# Altium project SCX10.PrjPCB
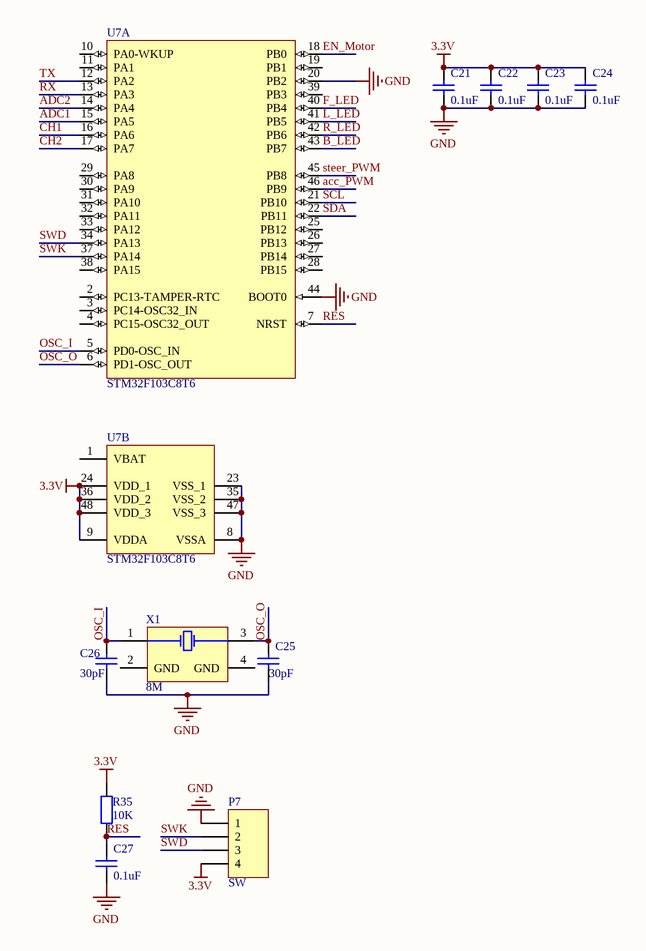
[diagram p0: SCX10.SchDoc]
3 sheets, 82 parts. Net scope: global (net labels, ports and power ports of the same name join across sheets).
Board file: SCX10.PcbDoc
Sheets:
  SCX10.SchDoc
  power.SchDoc
  driver.SchDoc

## Sheet SCX10.SchDoc
size A4

### Parts
C21  0.1uF  [C0603]
C22  0.1uF  [C0603]
C23  0.1uF  [C0603]
C24  0.1uF  [C0603]
C25  30pF  [C0603]
C26  30pF  [C0603]
C27  0.1uF  [C0603]
P7  SW  [HDR1X4]
R35  10K  [R0603]
U7  STM32F103C8T6  [STM-LQFP48-L]  (parts A,B of 2)
X1  8M  [XTAL-8M]

### Nets
3.3V: C21.2 C22.2 C23.2 C24.2 P7.4 R35.2 U7.9(VDDA) U7.24(VDD_1) U7.36(VDD_2) U7.48(VDD_3)
GND: C21.1 C22.1 C23.1 C24.1 C25.1 C26.1 C27.1 P7.1 U7.8(VSSA) U7.20(PB2) U7.23(VSS_1) U7.35(VSS_2) U7.44(BOOT0) U7.47(VSS_3)
acc_PWM: U7.46(PB9)
ADC1: U7.15(PA5)
ADC2: U7.14(PA4)
B_LED: U7.43(PB7)
CH1: U7.16(PA6)
CH2: U7.17(PA7)
EN_Motor: U7.18(PB0)
F_LED: U7.40(PB4)
L_LED: U7.41(PB5)
OSC_I: C26.2 U7.5(PD0-OSC_IN) X1.1(X1)
OSC_O: C25.2 U7.6(PD1-OSC_OUT) X1.3(X2)
R_LED: U7.42(PB6)
RES: C27.2 R35.1 U7.7(NRST)
RX: U7.13(PA3)
SCL: U7.21(PB10)
SDA: U7.22(PB11)
steer_PWM: U7.45(PB8)
SWD: P7.3 U7.34(PA13)
SWK: P7.2 U7.37(PA14)
TX: U7.12(PA2)

Not connected (* = marked no-connect by the designer): U7 1(VBAT) 2(PC13-TAMPER-RTC) 3(PC14-OSC32_IN) 4(PC15-OSC32_OUT) 10(PA0-WKUP) 11(PA1) 19(PB1) 25(PB12) 26(PB13) 27(PB14) 28(PB15) 29(PA8) 30(PA9) 31(PA10) 32(PA11) 33(PA12) 38(PA15) 39(PB3); X1 2(GND) 4(GND)

### Library data of the parts
C21-C27 = Cap: Capacitor; Value: 100pF; Published: 8-Jun-2000; LatestRevisionDate: 17-Jul-2002; LatestRevisionNote: Re-released for DXP Platform.; PackageReference: RAD-0.3; Publisher: Altium Limited; PackageDescription: Radial Cap, Thru-Hole; 2 Leads; 0.3 in Pin Spacing
P7 = Header 4: Header, 4-Pin; LatestRevisionDate: 17-Jul-2002; LatestRevisionNote: Re-released for DXP Platform.; Publisher: Altium Limited
R35 = Res2: Resistor; Value: 1K; Published: 8-Jun-2000; LatestRevisionDate: 17-Jul-2002; LatestRevisionNote: Re-released for DXP Platform.; PackageReference: AXIAL-0.4; Publisher: Altium Limited; PackageDescription: Axial Device, Thru-Hole; 2 Leads; 0.4 in Pin Spacing
X1 = XTAL-8M

## Sheet power.SchDoc
size A4
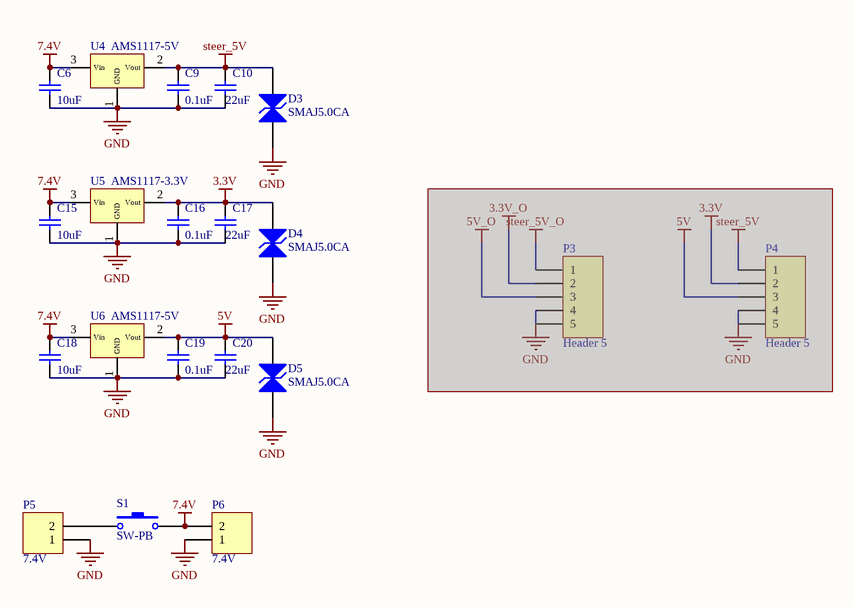
[diagram p1: power.SchDoc]

### Parts
(Parts that share a designator on the sheet are numbered #1, #2 ... from top to bottom, then left to right.)
C6  10uF  [C0603]
C9  0.1uF  [C0603]
C10  22uF  [C0603]
C15  10uF  [C0603]
C16  0.1uF  [C0603]
C17  22uF  [C0603]
C18  10uF  [C0603]
C19  0.1uF  [C0603]
C20  22uF  [C0603]
D3  SMAJ5.0CA  [DO-214AC]
D4  SMAJ5.0CA  [DO-214AC]
D5  SMAJ5.0CA  [DO-214AC]
P3#1  Header 5  [HDR1X5]  (masked out: inside a compile mask, not in the netlist)
P4  Header 5  [HDR1X5]  (masked out: inside a compile mask, not in the netlist)
P5  7.4V  [7.4V]
P6  7.4V  [7.4V]
S1  SW-PB  [7.4V]
U4  AMS1117-5V  [SOT-89]
U5  AMS1117-3.3V  [SOT-89]
U6  AMS1117-5V  [SOT-89]

### Nets
3.3V: C16.2 C17.2 D4.2(A2) U5.2(Vout)
5V: C19.2 C20.2 D5.2(A2) U6.2(Vout)
7.4V: C6.2 C15.2 C18.2 P6.2 S1.2 U4.3(Vin) U5.3(Vin) U6.3(Vin)
GND: C6.1 C9.1 C10.1 C15.1 C16.1 C17.1 C18.1 C19.1 C20.1 D3.1(A1) D4.1(A1) D5.1(A1) P5.1 P6.1 U4.1(GND) U5.1(GND) U6.1(GND)
steer_5V: C9.2 C10.2 D3.2(A2) U4.2(Vout)
NetP5_2: P5.2 S1.1

### Library data of the parts
C6 C9 C10 C15-C20 = Cap: Capacitor; Value: 100pF; Published: 8-Jun-2000; LatestRevisionDate: 17-Jul-2002; LatestRevisionNote: Re-released for DXP Platform.; PackageReference: RAD-0.3; Publisher: Altium Limited; PackageDescription: Radial Cap, Thru-Hole; 2 Leads; 0.3 in Pin Spacing
P3#1 P4 = Header 5: Header, 5-Pin; LatestRevisionDate: 17-Jul-2002; LatestRevisionNote: Re-released for DXP Platform.; Publisher: Altium Limited
P5 P6 = Header 2: Header, 2-Pin; LatestRevisionDate: 17-Jul-2002; LatestRevisionNote: Re-released for DXP Platform.; Publisher: Altium Limited
S1 = SW-PB: Switch; Published: 24-Mar-1999; LatestRevisionDate: 17-Jul-2002; LatestRevisionNote: Re-released for DXP Platform.; PackageReference: SPST-2; Publisher: Altium Limited; PackageDescription: Switch; 2 Leads
U4-U6 = AMS1117

## Sheet driver.SchDoc
size A4
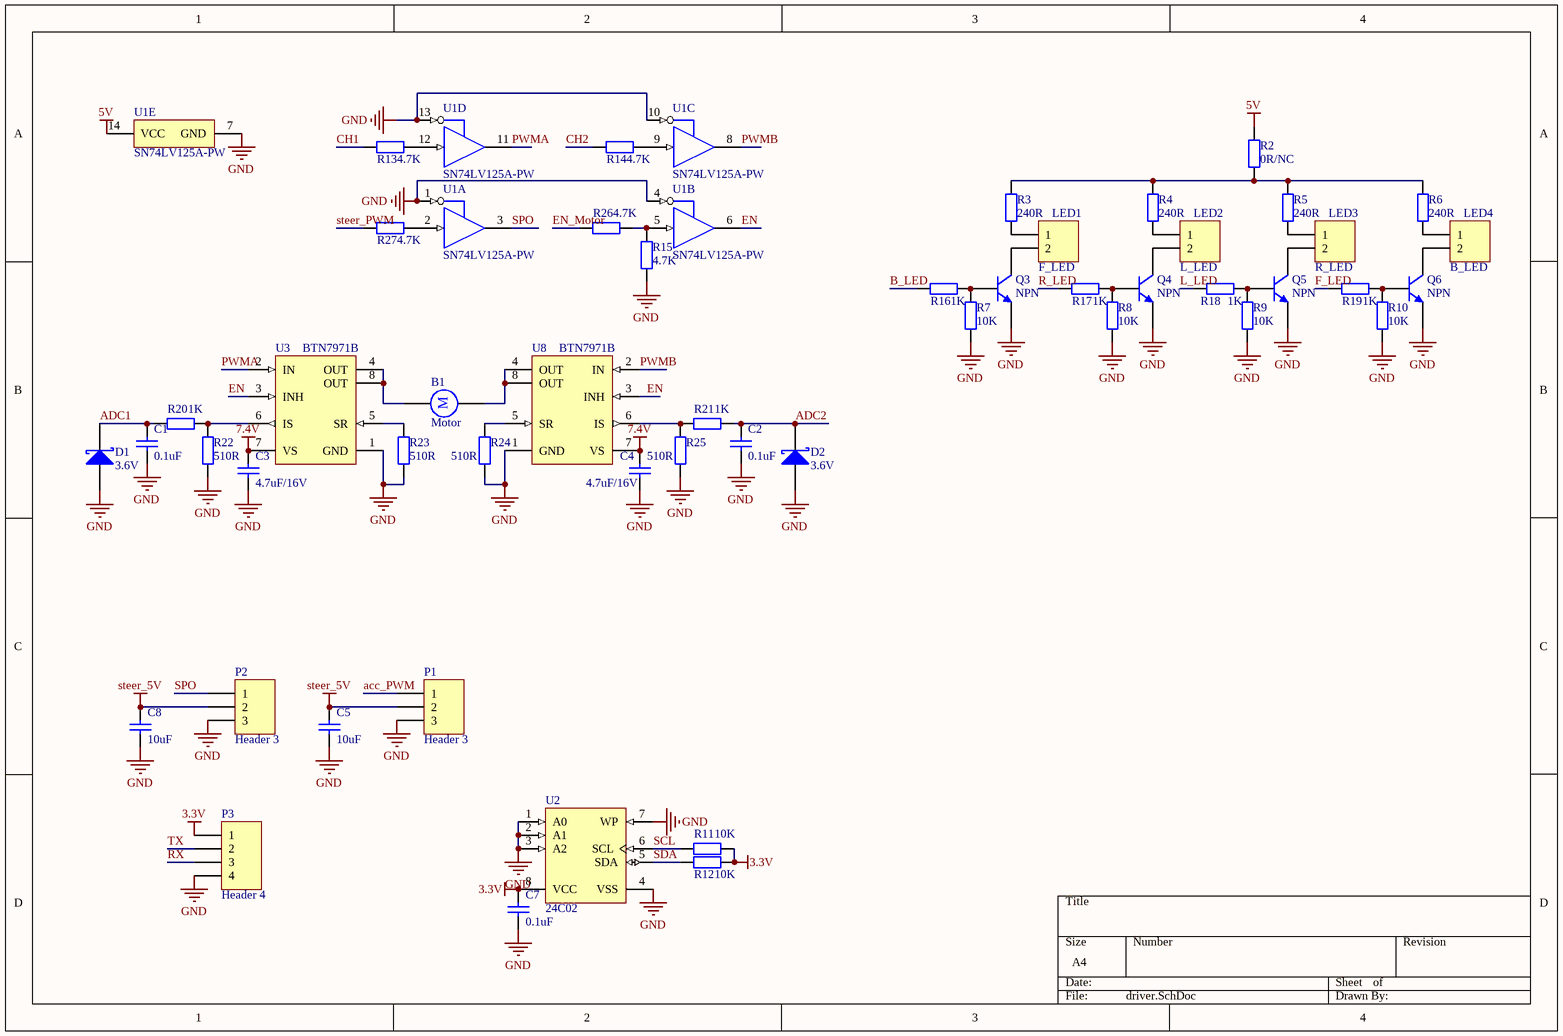
[diagram p2: driver.SchDoc]

### Parts
(Parts that share a designator on the sheet are numbered #1, #2 ... from top to bottom, then left to right.)
B1  Motor  [7.4V]
C1  0.1uF  [C0603]
C2  0.1uF  [C0603]
C3  4.7uF/16V  [6-0805_M]
C4  4.7uF/16V  [6-0805_M]
C5  10uF  [C0603]
C7  0.1uF  [C0603]
C8  10uF  [C0603]
D1  3.6V  [C1206]
D2  3.6V  [C1206]
LED1  F_LED  [HDR1X2]
LED2  L_LED  [HDR1X2]
LED3  R_LED  [HDR1X2]
LED4  B_LED  [HDR1X2]
P1  Header 3  [HDR1X3]
P2  Header 3  [HDR1X3]
P3#2  Header 4  [HDR1X4]
Q3  NPN  [SOT23-3]
Q4  NPN  [SOT23-3]
Q5  NPN  [SOT23-3]
Q6  NPN  [SOT23-3]
R2  0R/NC  [R0603]
R3  240R  [R0603]
R4  240R  [R0603]
R5  240R  [R0603]
R6  240R  [R0603]
R7  10K  [R0603]
R8  10K  [R0603]
R9  10K  [R0603]
R10  10K  [R0603]
R11  10K  [R0603]
R12  10K  [R0603]
R13  4.7K  [R0603]
R14  4.7K  [R0603]
R15  4.7K  [R0603]
R16  1K  [R0603]
R17  1K  [R0603]
R18  1K  [R0603]
R19  1K  [R0603]
R20  1K  [R0603]
R21  1K  [R0603]
R22  510R  [R0603]
R23  510R  [R0603]
R24  510R  [R0603]
R25  510R  [R0603]
R26  4.7K  [R0603]
R27  4.7K  [R0603]
U1  SN74LV125A-PW  [TSSOP-14]  (parts A,B,C,D,E of 5)
U2  24C02  [SOP-8]
U3  BTN7971B  [INF-PG-TO263-7-1_L - Cloned]
U8  BTN7971B  [INF-PG-TO263-7-1_L - Cloned]

### Nets
3.3V: C7.2 P3#2.1 R11.2 R12.2 U2.8(VCC)
5V: R2.1 U1.14(VCC)
7.4V: C3.2 C4.2 U3.7(VS) U8.7(VS)
GND: C1.1 C2.1 C3.1 C4.1 C5.1 C7.1 C8.1 D1.1(A) D2.1(A) P1.3 P2.3 P3#2.4 Q3.2(E) Q4.2(E) Q5.2(E) Q6.2(E) R7.2 R8.2 R9.2 R10.2 R15.1 R22.2 R23.2 R24.2 R25.2 U1.1(1~{OE}) U1.4(2~{OE}) U1.7(GND) U1.10(3~{OE}) U1.13(4~{OE}) U2.1(A0) U2.2(A1) U2.3(A2) U2.4(VSS) U2.7(WP) U3.1(GND) U8.1(GND)
steer_5V: C5.2 C8.2 P1.2 P2.2
acc_PWM: P1.1
ADC1: C1.2 D1.2(K) R20.1
ADC2: C2.2 D2.2(K) R21.2
B_LED: R16.1
CH1: R13.1
CH2: R14.1
EN: U1.6(2Y) U3.3(INH) U8.3(INH)
EN_Motor: R26.1
F_LED: R19.1
L_LED: R18.1
PWMA: U1.11(4Y) U3.2(IN)
PWMB: U1.8(3Y) U8.2(IN)
R_LED: R17.1
RX: P3#2.3
SCL: R11.1 U2.6(SCL)
SDA: R12.1 U2.5(SDA)
SPO: P2.1 U1.3(1Y)
steer_PWM: R27.1
TX: P3#2.2
NetB1_1: B1.1 U3.4(OUT) U3.8(OUT)
NetB1_2: B1.2 U8.4(OUT) U8.8(OUT)
NetLED1_1: LED1.1 R3.2
NetLED1_2: LED1.2 Q3.3(C)
NetLED2_1: LED2.1 R4.2
NetLED2_2: LED2.2 Q4.3(C)
NetLED3_1: LED3.1 R5.2
NetLED3_2: LED3.2 Q5.3(C)
NetLED4_1: LED4.1 R6.2
NetLED4_2: LED4.2 Q6.3(C)
NetQ3_1: Q3.1(B) R7.1 R16.2
NetQ4_1: Q4.1(B) R8.1 R17.2
NetQ5_1: Q5.1(B) R9.1 R18.2
NetQ6_1: Q6.1(B) R10.1 R19.2
NetR2_2: R2.2 R3.1 R4.1 R5.1 R6.1
NetR13_2: R13.2 U1.12(4A)
NetR14_2: R14.2 U1.9(3A)
NetR15_2: R15.2 R26.2 U1.5(2A)
NetR20_2: R20.2 R22.1 U3.6(IS)
NetR21_1: R21.1 R25.1 U8.6(IS)
NetR23_1: R23.1 U3.5(SR)
NetR24_1: R24.1 U8.5(SR)
NetR27_2: R27.2 U1.2(1A)

### Notes on the sheet
- (in symbol Motor) M

### Library data of the parts
B1 = Motor: Motor, General Kind; Published: 24-Mar-1999; LatestRevisionDate: 17-Jul-2002; LatestRevisionNote: Re-released for DXP Platform.; PackageReference: RB5-10.5; Publisher: Altium Limited; PackageDescription: Capacitor (Radial); 2 Leads
C1-C5 C7 C8 = Cap: Capacitor; Value: 100pF; Published: 8-Jun-2000; LatestRevisionDate: 17-Jul-2002; LatestRevisionNote: Re-released for DXP Platform.; PackageReference: RAD-0.3; Publisher: Altium Limited; PackageDescription: Radial Cap, Thru-Hole; 2 Leads; 0.3 in Pin Spacing
D1 D2 = D Schottky: Schottky Diode; Published: 8-Jun-2000; LatestRevisionDate: 17-Jul-2002; LatestRevisionNote: Re-released for DXP Platform.; PackageReference: SMB; Publisher: Altium Limited; PackageDescription: DO-214-AA/SMB; 2 C-Bend Leads; Body 5.3 x 3.6 mm, inc. leads (LxW); Code_JEDEC: DO-214-AA
LED1-LED4 = Header 2: Header, 2-Pin; LatestRevisionDate: 17-Jul-2002; LatestRevisionNote: Re-released for DXP Platform.; Publisher: Altium Limited
P1 P2 = Header 3: Header, 3-Pin; LatestRevisionDate: 17-Jul-2002; LatestRevisionNote: Re-released for DXP Platform.; Publisher: Altium Limited
P3#2 = Header 4: Header, 4-Pin; LatestRevisionDate: 17-Jul-2002; LatestRevisionNote: Re-released for DXP Platform.; Publisher: Altium Limited
R2-R15 R22-R27 = Res2: Resistor; Value: 1K; Published: 8-Jun-2000; LatestRevisionDate: 17-Jul-2002; LatestRevisionNote: Re-released for DXP Platform.; PackageReference: AXIAL-0.4; Publisher: Altium Limited; PackageDescription: Axial Device, Thru-Hole; 2 Leads; 0.4 in Pin Spacing
R16-R21 = Res2: Resistor; Published: 8-Jun-2000; LatestRevisionDate: 17-Jul-2002; LatestRevisionNote: Re-released for DXP Platform.; PackageReference: AXIAL-0.4; Publisher: Altium Limited; PackageDescription: Axial Device, Thru-Hole; 2 Leads; 0.4 in Pin Spacing; Value: 1K
U3 U8 = INF-BTN79XXX-PG-TO263-7-1-8

## Nets that join several sheets
3.3V: SCX10 (10 pins), power (C16.2 C17.2 D4.2 U5.2), driver (5 pins)
5V: power (C19.2 C20.2 D5.2 U6.2), driver (R2.1 U1.14)
7.4V: power (8 pins), driver (C3.2 C4.2 U3.7 U8.7)
GND: SCX10 (14 pins), power (17 pins), driver (37 pins)
steer_5V: power (C9.2 C10.2 D3.2 U4.2), driver (C5.2 C8.2 P1.2 P2.2)
acc_PWM: SCX10 (U7.46), driver (P1.1)
ADC1: SCX10 (U7.15), driver (C1.2 D1.2 R20.1)
ADC2: SCX10 (U7.14), driver (C2.2 D2.2 R21.2)
B_LED: SCX10 (U7.43), driver (R16.1)
CH1: SCX10 (U7.16), driver (R13.1)
CH2: SCX10 (U7.17), driver (R14.1)
EN_Motor: SCX10 (U7.18), driver (R26.1)
F_LED: SCX10 (U7.40), driver (R19.1)
L_LED: SCX10 (U7.41), driver (R18.1)
R_LED: SCX10 (U7.42), driver (R17.1)
RX: SCX10 (U7.13), driver (P3#2.3)
SCL: SCX10 (U7.21), driver (R11.1 U2.6)
SDA: SCX10 (U7.22), driver (R12.1 U2.5)
steer_PWM: SCX10 (U7.45), driver (R27.1)
TX: SCX10 (U7.12), driver (P3#2.2)